# Altium schematic sheet PW_OTHER.SchDoc
size A3; SheetNumber: 25; SheetTotal: 31
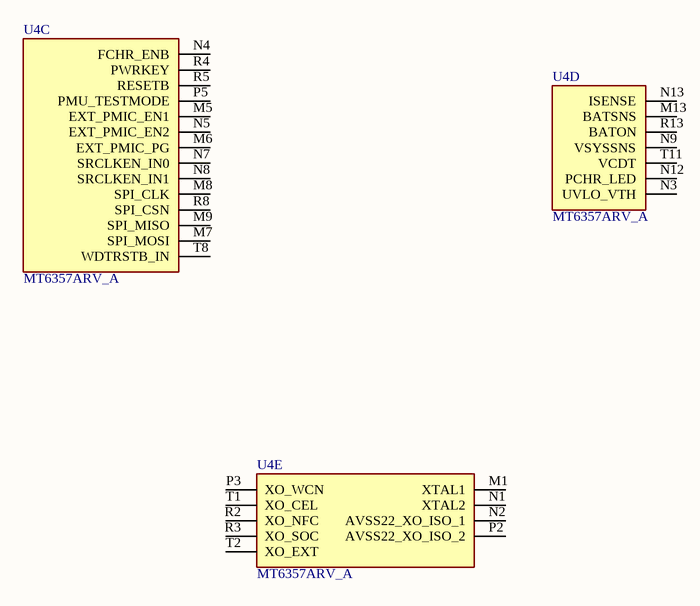
[diagram p0: PW_OTHER.SchDoc]

## Parts
U4  MT6357ARV_A  [BGA209C40P17X16_700X660X100]  (parts C,D,E of 8)

## Nets

Not connected (* = marked no-connect by the designer): U4 M1(XTAL1) M5(EXT_PMIC_EN1) M6(EXT_PMIC_PG) M7(SPI_MOSI) M8(SPI_CLK) M9(SPI_MISO) M13(BATSNS) N1(XTAL2) N2(AVSS22_XO_ISO_1) N3(UVLO_VTH) N4(FCHR_ENB) N5(EXT_PMIC_EN2) N7(SRCLKEN_IN0) N8(SRCLKEN_IN1) N9(VSYSSNS) N12(PCHR_LED) N13(ISENSE) P2(AVSS22_XO_ISO_2) P3(XO_WCN) P5(PMU_TESTMODE) R2(XO_NFC) R3(XO_SOC) R4(PWRKEY) R5(RESETB) R8(SPI_CSN) R13(BATON) T1(XO_CEL) T2(XO_EXT) T8(WDTRSTB_IN) T11(VCDT)

## Library data of the parts
U4 = MT6357ARV_A: Integrated Circuit; Manufacturer_Name: Mediatek; Manufacturer_Part_Number: MT6357ARV/A; Datasheet Link: https://mediatek-marketing.files.svdcdn.com/production/documents/Genio-PMICs/MTK_MT6357_Product-Brief_v1.0.pdf?dm=1696608680; Height: 1mm; Mouser Part Number: 840-MT6357ARV/A; Mouser Price/Stock: https://www.mouser.co.uk/ProductDetail/MediaTek/MT6357ARV-A?qs=Jm2GQyTW%2Fbim3iWdQ0ZJPw%3D%3D